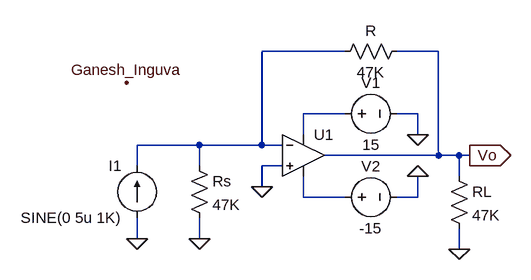
[diagram p0: schematic Run 2_B.asc]
Run 2_B.asc, the LTspice schematic file:
Version 4
SHEET 1 880 680
WIRE 240 -16 112 -16
WIRE 384 -16 320 -16
WIRE 240 80 176 80
WIRE 352 80 320 80
WIRE 176 112 176 80
WIRE 352 112 352 80
WIRE 16 128 -80 128
WIRE 112 128 112 -16
WIRE 112 128 16 128
WIRE 144 128 112 128
WIRE 384 144 384 -16
WIRE 384 144 208 144
WIRE 416 144 384 144
WIRE 432 144 416 144
WIRE -80 160 -80 128
WIRE 16 160 16 128
WIRE 144 160 112 160
WIRE 416 176 416 144
WIRE 112 192 112 160
WIRE 176 208 176 176
WIRE 240 208 176 208
WIRE 352 208 352 176
WIRE 352 208 320 208
WIRE -80 272 -80 240
WIRE 16 272 16 240
WIRE 416 288 416 256
FLAG 352 112 0
FLAG 352 176 0
FLAG 112 192 0
FLAG 416 288 0
FLAG 432 144 Vo
IOPIN 432 144 Out
FLAG 16 272 0
FLAG -80 272 0
FLAG -96 32 Ganesh_Inguva
SYMBOL OpAmps\\UniversalOpamp2 176 144 R0
SYMATTR InstName U1
SYMBOL voltage 224 80 R270
WINDOW 0 32 56 VTop 2
WINDOW 3 -32 56 VBottom 2
WINDOW 123 0 0 Left 0
WINDOW 39 0 0 Left 0
SYMATTR InstName V1
SYMATTR Value 15
SYMBOL voltage 224 208 R270
WINDOW 0 32 56 VTop 2
WINDOW 3 -32 56 VBottom 2
WINDOW 123 0 0 Left 0
WINDOW 39 0 0 Left 0
SYMATTR InstName V2
SYMATTR Value -15
SYMBOL res 336 -32 R90
WINDOW 0 0 56 VBottom 2
WINDOW 3 32 56 VTop 2
SYMATTR InstName R
SYMATTR Value 47K
SYMBOL res 400 160 R0
SYMATTR InstName RL
SYMATTR Value 47K
SYMBOL res 0 144 R0
SYMATTR InstName Rs
SYMATTR Value 47K
SYMBOL current -80 240 R180
WINDOW 0 24 80 Left 2
WINDOW 3 24 0 Left 2
WINDOW 123 0 0 Left 0
WINDOW 39 0 0 Left 0
SYMATTR InstName I1
SYMATTR Value SINE(0 5u 1K)

The netlist it stands for:
* Run 2_B.asc
XU1 0 N001 N002 N003 Vo level.2 Avol=1Meg GBW=10Meg Slew=10Meg ilimit=25m rail=0 Vos=0 phimargin=45 en=0 enk=0 in=0 ink=0 Rin=500Meg  ; pins IN+ IN- V+ V- OUT
V1 N002 0 15
V2 N003 0 -15
R Vo N001 47K
RL Vo 0 47K
Rs N001 0 47K
I1 0 N001 SINE(0 5u 1K)
.lib UniversalOpamps2.sub
.backanno
.end